# Altium schematic sheet 8586.SchDoc
size A1
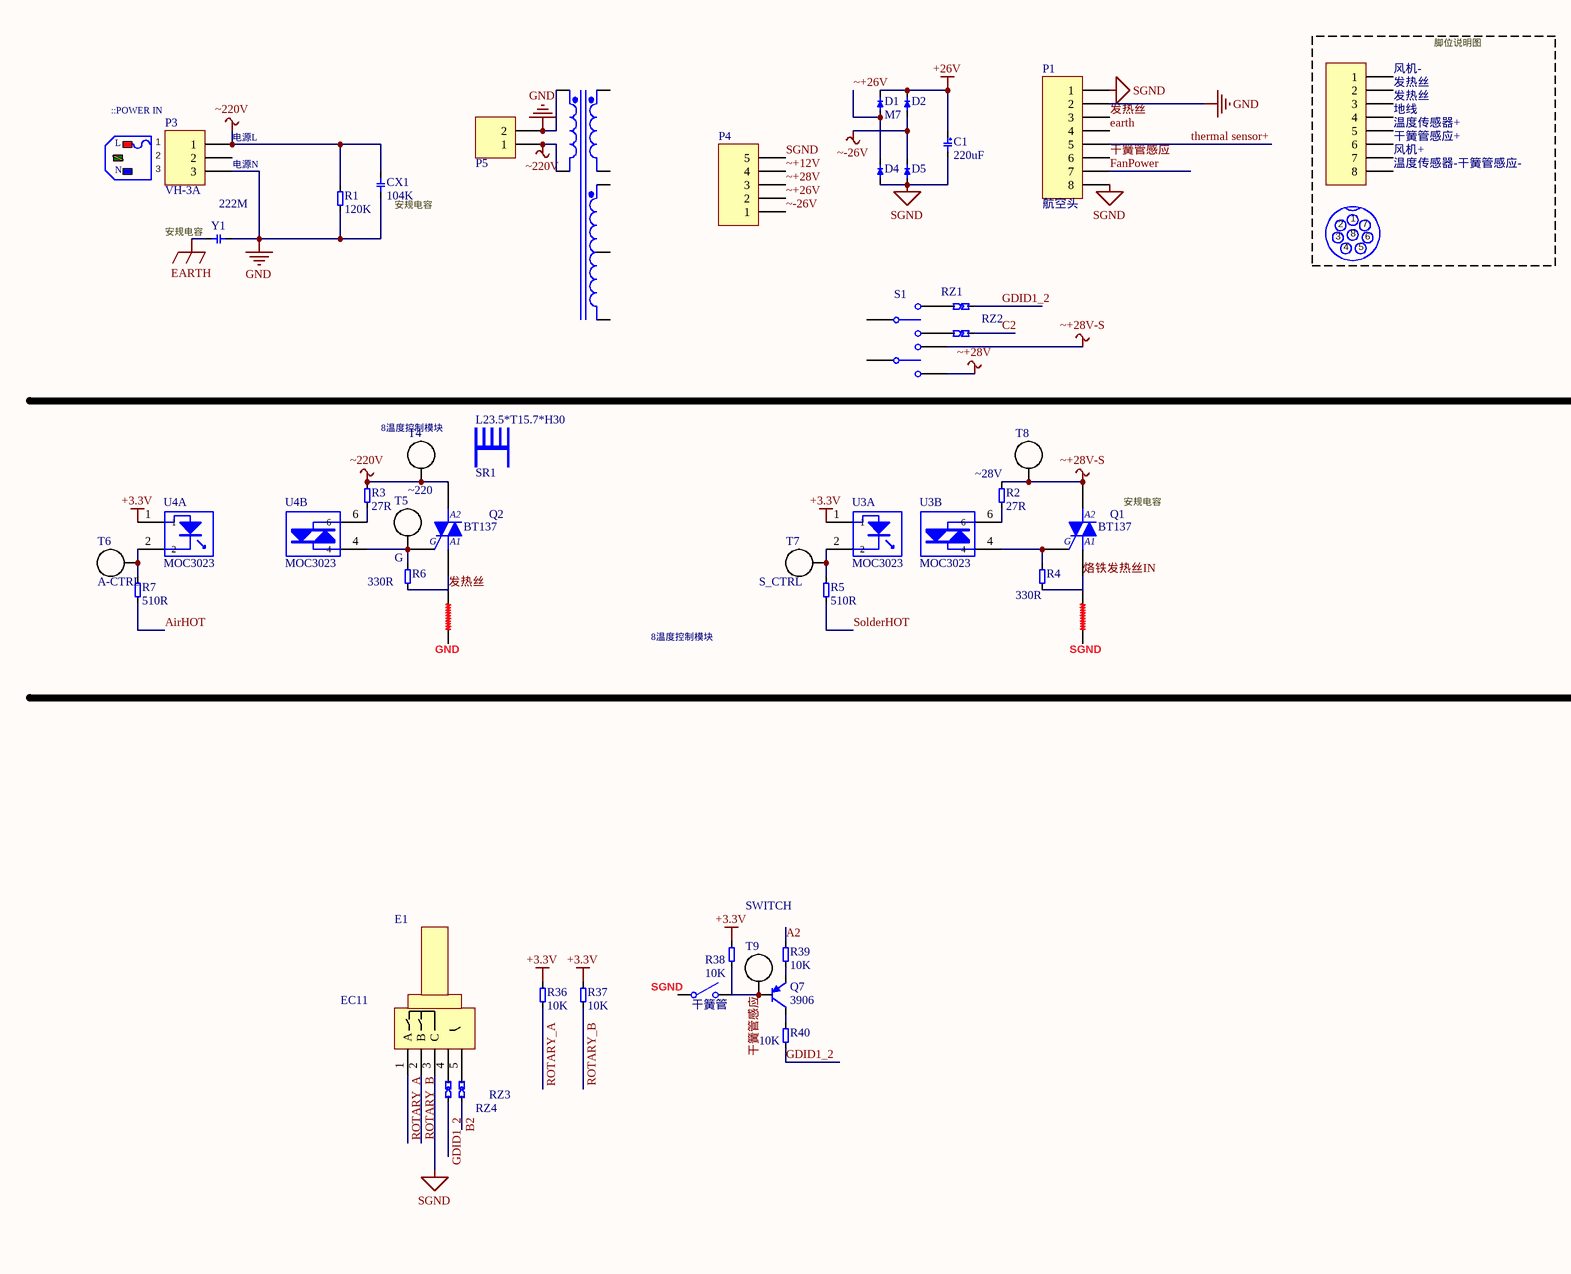
[diagram p0: 8586.SchDoc, top left]
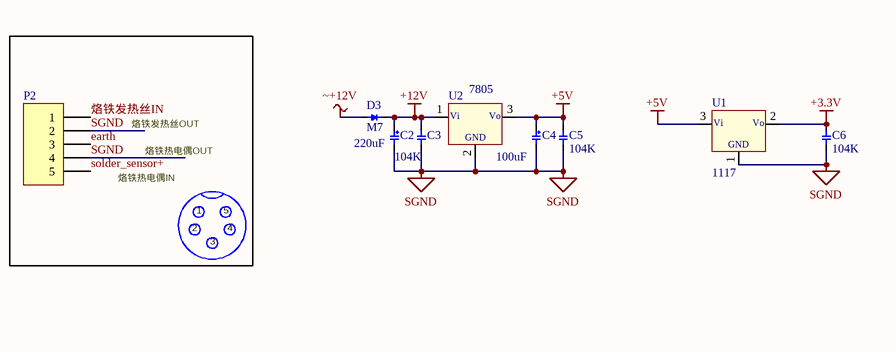
[diagram p1: 8586.SchDoc, top right]
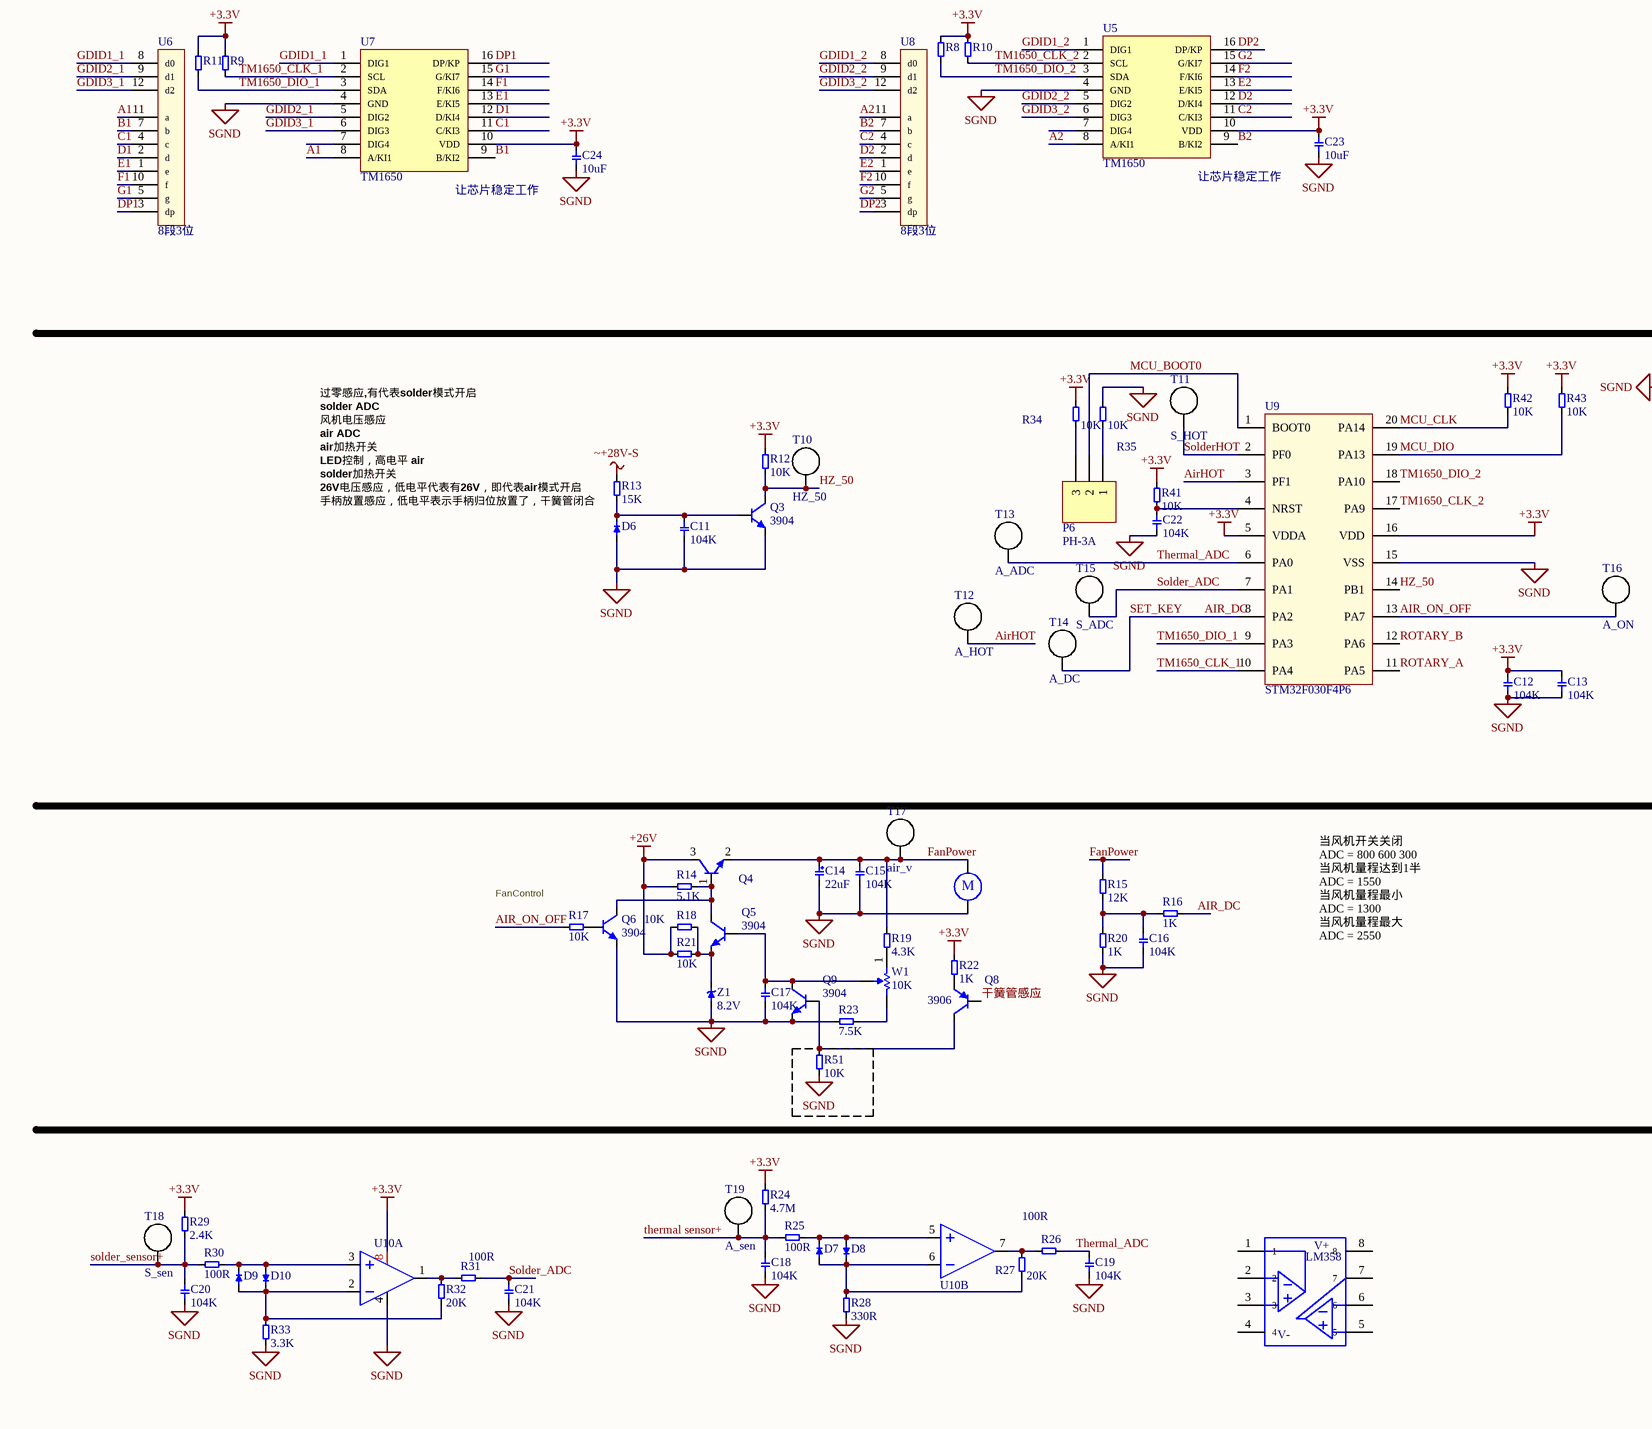
[diagram p2: 8586.SchDoc, bottom left]
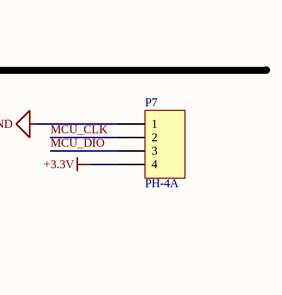
[diagram p3: 8586.SchDoc, bottom right]

## Parts
(Parts that share a designator on the sheet are numbered #1, #2 ... from top to bottom, then left to right.)
?#1  发热丝图  [CON2-3.96]  (value not drawn)  (graphical)
?#2  发热丝图  [CON2-3.96]  (value not drawn)  (graphical)
B?  Motor  [2PIN孔1.7]  (value not drawn)  (graphical)
C1  220uF  [P5D13H27]
C2  220uF  [P3.5D8H13]
C3  104K  [0805]
C4  100uF  [P2.54D5H11]
C5  104K  [0805]
C6  104K  [0805]
C11  104K  [0805]
C12  104K  [0805]
C13  104K  [0805]
C14  22uF  [P2.54D5H11]
C15  104K  [0805]
C16  104K  [0805]
C17  104K  [0805]
C18  104K  [0805]
C19  104K  [0805]
C20  104K  [0805]
C21  104K  [0805]
C22  104K  [0805]
C23  10uF  [0805]
C24  10uF  [0805]
CX1  104K  [方形P15T6L18H12]
D1  M7  [SMA]
D2  M7  [SMA]  (value not drawn)
D3  M7  [SMA]
D4  M7  [SMA]  (value not drawn)
D5  M7  [SMA]  (value not drawn)
D6  M7  [SMA]  (value not drawn)
D7  M7  [SOD123]  (value not drawn)
D8  M7  [SOD123]  (value not drawn)
D9  M7  [SOD123]  (value not drawn)
D10  M7  [SOD123]  (value not drawn)
E1  EC11  [EC11]
P1  航空头  [航空头8PIN]
P2  VH-5A  [航空头5PIN]  (value not drawn)
P3  VH-3A  [CON3-P3.96]
P4  VH-5A  [CON5-P3.96]  (value not drawn)
P5#1  航空头8PIN  [航空头8PIN]  (value not drawn)  (graphical)
P5#2  VH-2A  [CON2-P3.96]  (value not drawn)
P6  PH-3A  [CON3-P2.54]
P7  PH-4A  [CON4-P2.54]
P?#1  品字插座  [IEC9.14-2H3]  (value not drawn)  (graphical)
P?#2  航空头5PIN  (value not drawn)  (graphical)
P?#3  航空头8PIN  (value not drawn)  (graphical)
Q1  BT137  [TO-220-3L-P2.54]
Q2  BT137  [TO-220-3L-P2.54]
Q3  3904  [SOT-23-3L]
Q4  TIP122  [TO-220-3L-P2.54]  (value not drawn)
Q5  3904  [SOT-23-3L]
Q6  3904  [SOT-23-3L]
Q7  3906  [SOT-23-3L]
Q8  3906  [SOT-23-3L]
Q9  3904  [SOT-23-3L]
R1  120K  [1206]
R2  27R  [0805]
R3  27R  [0805]
R4  330R  [0805]
R5  510R  [0805]
R6  330R  [0805]
R7  510R  [0805]
R8  10K  [0805]  (value not drawn)
R9  10K  [0805]  (value not drawn)
R10  10K  [0805]  (value not drawn)
R11  10K  [0805]  (value not drawn)
R12  10K  [0805]
R13  15K  [0805]
R14  5.1K  [0805]
R15  12K  [0805]
R16  1K  [0805]
R17  10K  [0805]
R18  10K  [0805]
R19  4.3K  [0805]
R20  1K  [0805]
R21  10K  [0805]
R22  1K  [0805]
R23  7.5K  [0805]
R24  4.7M  [0805]
R25  100R  [0805]
R26  100R  [0805]
R27  20K  [0805]
R28  330R  [0805]
R29  2.4K  [0805]
R30  100R  [0805]
R31  100R  [0805]
R32  20K  [0805]
R33  3.3K  [0805]
R34  10K  [0805]
R35  10K  [0805]
R36  10K  [0805]
R37  10K  [0805]
R38  10K  [0805]
R39  10K  [0805]
R40  10K  [0805]
R41  10K  [0805]
R42  10K  [0805]
R43  10K  [0805]
R51  10K  [0805]
RZ1  (no value)  [跳线-小]  (no BOM)
RZ2  (no value)  [跳线-小]  (no BOM)
RZ3  (no value)  [跳线2012]  (no BOM)
RZ4  (no value)  [跳线2012]  (no BOM)
S1  KCD6  [开关-船式 - 双]  (value not drawn)
S?  干簧管  [SPST-2]  (graphical)
SR1  L23.5*T15.7*H30  [散热片L23.5*T15.7*H30]
T4  ~220  [test_dot_6]
T5  G  [test_dot_6]
T6  A-CTRL  [test_dot_6]
T7  S_CTRL  [test_dot_6]
T8  ~28V  [test_dot_6]
T9  SWITCH  [test_dot_6]
T10  HZ_50  [test_dot_6]
T11  S_HOT  [test_dot_6]
T12  A_HOT  [test_dot_6]
T13  A_ADC  [test_dot_6]
T14  A_DC  [test_dot_6]
T15  S_ADC  [test_dot_6]
T16  A_ON  [test_dot_6]
T17  air_v  [test_dot_6]
T18  S_sen  [test_dot_6]
T19  A_sen  [test_dot_6]
T?  Trans4_1  [TRF_8]  (value not drawn)  (graphical)
U1  1117  [SOT89L]
U2  7805  [TO-220-3L-P2.54]
U3  MOC3023  [SOP-6]  (parts A,B of 2)
U4  MOC3023  [SOP-6]  (parts A,B of 2)
U5  TM1650  [SOIC16_39MM]
U6  8段3位  [数码管]
U7  TM1650  [SOIC16_39MM]
U8  8段3位  [数码管]
U9  STM32F030F4P6  [TSSOP20引脚加长]
U10  LM358  [SOIC8_39MM]  (value not drawn)  (parts A,B of 2)
U?  LM358  [DIP-8]  (graphical)
W1  10K  [R16P5.083PIN]
Y1  222M  [椭圆T3.3P10]
Z1  8.2V  [SOD123]

## Nets
+3.3V: C6.2 C12.2 C13.2 C23.2 C24.2 P7.4 R8.2 R9.2 R10.2 R11.2 R12.2 R22.1 R24.1 R29.1 R34.2 R36.2 R37.2 R38.2 R41.1 R42.2 R43.2 U1.2(Vo) U3.1 U4.1 U5.10(VDD) U7.10(VDD) U9.5(VDDA) U9.16(VDD) U10.8(V+)
+5V: C4.1 C5.2 U1.3(Vi) U2.3(GND)
+12V: C2.1 C3.2 D3.1 U2.1(INPUT)
+26V: C1.1 D1.1 D2.1 Q4.3(C) R14.2 R18.2 R21.2
earth: P1.4 P2.3 Y1.1
GND: CX1.1 P1.2 P3.3 P5#2.2 R1.1 T?.1(Pri+) Y1.2
SGND: B?.2 C1.2 C2.2 C3.1 C4.2 C5.1 C6.1 C11.1 C12.1 C13.1 C14.2 C15.1 C16.1 C17.1 C18.1 C19.1 C20.1 C21.1 C22.1 C23.1 C24.1 D4.2 D5.2 D6.2 E1.3(C) P1.1 P1.8 P2.2 P2.4 P4.5 P7.1 Q3.2(E) Q6.2(E) Q9.2(E) R20.2 R23.2 R28.2 R33.2 R35.2 R51.2 U1.1(GND) U2.2(OUTPUT) U5.4(GND) U7.4(GND) U9.15(VSS) U10.4(V-) Z1.2
~220V: CX1.2 P3.1 P5#2.1 Q2.2(A2) R1.2 R3.2 T4.1 T?.2(Pri-)
~+12V: D3.2 P4.4
~+28V: P4.3 S1.6
~+28V-S: Q1.2(A2) R2.2 R13.2 S1.5 T8.1
~-26V: D2.2 D5.1 P4.1
A1: U6.11(a) U7.8(A/KI1)
A2: R39.2 U5.8(A/KI1) U8.11(a)
AIR_DC: R16.2 T14.1 U9.8(PA2)  [also labelled SET_KEY]
AIR_ON_OFF: R17.2 T16.1 U9.13(PA7)
AirHOT: R7.2 T12.1 U9.3(PF1)
B1: U6.7(b) U7.9(B/KI2)
B2: RZ3.1 U5.9(B/KI2) U8.7(b)
C1: U6.4(c) U7.11(C/KI3)
C2: RZ2.2 U5.11(C/KI3) U8.4(c)
D1: U6.2(d) U7.12(D/KI4)
D2: U5.12(D/KI4) U8.2(d)
DP1: U6.3(dp) U7.16(DP/KP)
DP2: U5.16(DP/KP) U8.3(dp)
E1: U6.1(e) U7.13(E/KI5)
E2: U5.13(E/KI5) U8.1(e)
F1: U6.10(f) U7.14(F/KI6)
F2: U5.14(F/KI6) U8.10(f)
FanPower: B?.1 C14.1 C15.2 P1.7 Q4.2(E) R15.1 R19.1 T17.1
G1: U6.5(g) U7.15(G/KI7)
G2: U5.15(G/KI7) U8.5(g)
GDID1_1: U6.8(d0) U7.1(DIG1)
GDID1_2: R40.1 RZ1.2 RZ4.1 U5.1(DIG1) U8.8(d0)
GDID2_1: U6.9(d1) U7.5(DIG2)
GDID2_2: U5.5(DIG2) U8.9(d1)
GDID3_1: U6.12(d2) U7.6(DIG3)
GDID3_2: U5.6(DIG3) U8.12(d2)
HZ_50: Q3.3(C) R12.1 T10.1 U9.14(PB1)
MCU_BOOT0: P6.2 U9.1(BOOT0)
MCU_CLK: P7.2 R42.1 U9.20(PA14)
MCU_DIO: P7.3 R43.1 U9.19(PA13)
ROTARY_A: E1.1(A) R36.1 U9.11(PA5)
ROTARY_B: E1.2(B) R37.1 U9.12(PA6)
Solder_ADC: C21.2 R31.1 T15.1 U9.7(PA1)
solder_sensor+: C20.2 P2.5 R29.2 R30.1 T18.1
SolderHOT: R5.2 T11.1 U9.2(PF0)
thermal sensor+: C18.2 P1.5 R24.2 R25.1 T19.1
Thermal_ADC: C19.2 R26.1 T13.1 U9.6(PA0)
TM1650_CLK_1: R9.1 U7.2(SCL) U9.10(PA4)
TM1650_CLK_2: R10.1 U5.2(SCL) U9.17(PA9)
TM1650_DIO_1: R11.1 U7.3(SDA) U9.9(PA3)
TM1650_DIO_2: R8.1 U5.3(SDA) U9.18(PA10)
~+26V: D1.2 D4.1 P4.2
发热丝: ?#1.1 P1.3 Q2.1(A1) R6.2
干簧管感应: P1.6 Q7.1(B) Q8.1(B) R38.1 S?.2(NO) T9.1
烙铁发热丝IN: ?#2.1 P2.1 Q1.1(A1) R4.2
NetC11_2: C11.2 D6.1 Q3.1(B) R13.1
NetC16_2: C16.2 R15.2 R16.1 R20.1
NetC17_2: C17.2 Q5.1(B) Q9.3(C) W1.2
NetC22_2: C22.2 R41.2 U9.4(NRST)
NetD7_1: D7.1 D8.2 R25.2 U10.5(IN2+)
NetD7_2: D7.2 D8.1 R27.2 R28.1 U10.6(IN2-)
NetD9_1: D9.1 D10.2 R30.2 U10.3(IN1+)
NetD9_2: D9.2 D10.1 R32.2 R33.1 U10.2(IN1-)
NetE1_4: E1.4 RZ4.2
NetE1_5: E1.5 RZ3.2
NetP6_1: P6.1 R35.1
NetP6_3: P6.3 R34.1
NetQ1_3: Q1.3(G) R4.1 U3.4
NetQ2_3: Q2.3(G) R6.1 T5.1 U4.4
NetQ4_1: Q4.1(B) Q5.3(C) Q6.3(C) R14.1
NetQ5_2: Q5.2(E) R18.1 R21.1 Z1.1
NetQ6_1: Q6.1(B) R17.1
NetQ7_2: Q7.2(E) R39.1
NetQ7_3: Q7.3(C) R40.2
NetQ8_2: Q8.2(E) R22.2
NetQ8_3: Q8.3(C) Q9.1(B) R51.1
NetR2_1: R2.1 U3.6
NetR3_1: R3.1 U4.6
NetR5_1: R5.1 T7.1 U3.2
NetR7_1: R7.1 T6.1 U4.2
NetR19_2: R19.2 W1.1
NetR23_1: R23.1 W1.3
NetR26_2: R26.2 R27.1 U10.7(OUT2)
NetR31_2: R31.2 R32.1 U10.1(OUT1)
NetRZ1_1: RZ1.1 S1.2
NetRZ2_1: RZ2.1 S1.3

Not connected (* = marked no-connect by the designer): ?#1 2; ?#2 2; P3 2; P5#1 1 2 3 4 5 6 7 8; S1 1 4; S? 1(COMMON); T? 3(Sec1+) 4(Sec1-) 5(Sec2+) 6(Sec2-) 8(Sec3-); U5 7(DIG4); U7 7(DIG4); U? 1 2 3 4 5 6 7 8

## Notes on the sheet
- 脚位说明图
- (near P?#1) ::POWER IN
- (near P5#1) 风机-
- (near P5#1) 发热丝
- (near P5#1) 地线
- (near P3) 电源N
- (near P3) 电源L
- (near P5#1) 温度传感器+
- (near P5#1) 干簧管感应+
- (near P5#1) 风机+
- (near P5#1) 温度传感器-干簧管感应-
- 烙铁热电偶IN
- 烙铁发热丝OUT
- 烙铁热电偶OUT
- (near Y1) 安规电容
- (near CX1) 安规电容
- (near T4) 8温度控制模块
- (near Q1) 安规电容
- GND
- 8温度控制模块
- SGND
- (near S?) SGND
- (near U7) 让芯片稳定工作
- (near U5) 让芯片稳定工作
- 过零感应,有代表solder模式开启
- 风机电压感应
- solder ADC
- air ADC
- 26V电压感应，低电平代表有26V，即代表air模式开启
- 手柄放置感应，低电平表示手柄归位放置了，干簧管闭合
- LED控制，高电平 air
- air加热开关
- solder加热开关
- (near R17) FanControl
- 当风机开关关闭
  ADC = 800 600 300
  当风机量程达到1半
  ADC = 1550
  当风机量程最小
  ADC = 1300
  当风机量程最大
  ADC = 2550
- Title
- Size:
- Date:
- File:
- A1
- Number:
- Time:
- Revision:
- Sheet
- of
- (in symbol 7805) Vi; Vo
- (in symbol Motor) M
- (in symbol Plug AC Male_fuse) L; 1; 2; N; 3
- (in symbol 航空头5PIN) 1; 5; 2; 4; 3
- (in symbol 航空头8PIN) 1; 2; 7; 8; 3; 6; 4; 5
- (in symbol 运放LM358) V+; V-

## Library data of the parts
B? = Motor: Motor, General Kind; Published: 24-Mar-1999; LatestRevisionDate: 17-Jul-2002; LatestRevisionNote: Re-released for DXP Platform.; PackageReference: RB5-10.5; Publisher: Altium Limited
C1 = Cap Pol: 极性电容; specifications: 220uF,50V,±20%; Published: 8-Jun-2000; LatestRevisionDate: 17-Jul-2002; LatestRevisionNote: Re-released for DXP Platform.; PackageReference: RB7.6-15; Publisher: Altium Limited; Value: 220uF
C2 = Cap Pol: 极性电容; specifications: 220uF,25V,±20%; Published: 8-Jun-2000; LatestRevisionDate: 17-Jul-2002; LatestRevisionNote: Re-released for DXP Platform.; PackageReference: RB7.6-15; Publisher: Altium Limited; Value: 220uF
C3 C5 C6 C11-C13 C15-C24 = Cap: 电容; Specifications: 104K,16V,±10%; Published: 8-Jun-2000; LatestRevisionDate: 17-Jul-2002; LatestRevisionNote: Re-released for DXP Platform.; PackageReference: RAD-0.3; Publisher: Altium Limited
  C3 C5 C6 C11-C13 C15-C22: Value: 104K
  C23 C24: Value: 10uF
C4 = Cap Pol: 极性电容; specifications: 100uF,25V,±20%; Published: 8-Jun-2000; LatestRevisionDate: 17-Jul-2002; LatestRevisionNote: Re-released for DXP Platform.; PackageReference: RB7.6-15; Publisher: Altium Limited; Value: 100uF
C14 = Cap Pol: 极性电容; specifications: 22uF,50V,±20%; Published: 8-Jun-2000; LatestRevisionDate: 17-Jul-2002; LatestRevisionNote: Re-released for DXP Platform.; PackageReference: RB7.6-15; Publisher: Altium Limited; Value: 22uF
CX1 = Cap: 安规电容; Specifications: 104K,275V; Published: 8-Jun-2000; LatestRevisionDate: 17-Jul-2002; LatestRevisionNote: Re-released for DXP Platform.; PackageReference: RAD-0.3; Publisher: Altium Limited; Value: 104K
D1-D10 = Diode: 二极管; Published: 8-Jun-2000; LatestRevisionDate: 17-Jul-2002; LatestRevisionNote: Re-released for DXP Platform.; PackageVersion: Sep-1996; PackageReference: SMC; Publisher: Altium Limited; Code_JEDEC: DO-214-AB; value: M7; Specifications: M7
E1 = EC11_S: 旋转编码器; value: EC11; specifications: *
P1 = Header 8: 连接器; LatestRevisionDate: 17-Jul-2002; LatestRevisionNote: Re-released for DXP Platform.; Publisher: Altium Limited; Value: 航空头; specifications: 航空头
P2 P4 = Header 5: 连接器; Specifications: VH-5A直脚; LatestRevisionDate: 17-Jul-2002; LatestRevisionNote: Re-released for DXP Platform.; Publisher: Altium Limited; Value: VH-5A
P3 = Header 3: 连接器; Specifications: VH-3A直脚; LatestRevisionDate: 17-Jul-2002; LatestRevisionNote: Re-released for DXP Platform.; Publisher: Altium Limited; Value: VH-3A
P5#1 = Header 8: Header, 8-Pin; LatestRevisionDate: 17-Jul-2002; LatestRevisionNote: Re-released for DXP Platform.; Publisher: Altium Limited
P5#2 = Header 2: 连接器; Specifications: VH-2A直脚; LatestRevisionDate: 17-Jul-2002; LatestRevisionNote: Re-released for DXP Platform.; Publisher: Altium Limited; Value: VH-2A
P6 = Header 3: 连接器; Specifications: PH-3A直脚; LatestRevisionDate: 17-Jul-2002; LatestRevisionNote: Re-released for DXP Platform.; Publisher: Altium Limited; Value: PH-3A
P7 = Header 4: 连接器; LatestRevisionDate: 17-Jul-2002; LatestRevisionNote: Re-released for DXP Platform.; Publisher: Altium Limited; Value: PH-4A; specifications: PH-4A
P?#1 = Plug AC Male_fuse: 220V
Q1 Q2 = Triac: 可控硅; Note: Pin 2 is electrically connected to Pin 4 (TAB); Published: 29-Sep-2000; LatestRevisionDate: 17-Jul-2002; LatestRevisionNote: Re-released for DXP Platform.; DatasheetVersion: 1999; PackageReference: 369-03; Publisher: Altium Limited; Code_JEDEC: TO-251-AA; ComponentLink1Description: Manufacturer Link; ComponentLink1URL: http://www.motorola.com/; value: BT137; specifications: BT137
Q3 Q5 Q6 Q9 = transistor NPN: 三极管; Published: 8-Jun-2000; LatestRevisionDate: 17-Jul-2002; LatestRevisionNote: Re-released for DXP Platform.; PackageReference: TO-226; Publisher: Altium Limited; Code_JEDEC: TO-226-AA; Value: 3904; specifications: *
Q4 = TIP122: NPN; pin to pad: 2>3 3>2; Published: 8-Jun-2000; LatestRevisionDate: 17-Jul-2002; LatestRevisionNote: Re-released for DXP Platform.; PackageReference: TO-226; Publisher: Altium Limited; Code_JEDEC: TO-226-AA; value: TIP122; specifications: TIP122
Q7 Q8 = transistor PNP: 三极管; Published: 8-Jun-2000; LatestRevisionDate: 29-May-2009; LatestRevisionNote: IPC-7351 Footprint Added.; PackageVersion: Aug-1999; PackageReference: SOT-23B; Publisher: Altium Limited; PackageDescription: 3-Pin SOT-23 Package 0.95 mm Pitch, 2.4 mm Lead Span; Value: 3906; specifications: 3906
R1 = Res1: 电阻; Specifications: 120K,±1%; Published: 8-Jun-2000; LatestRevisionDate: 17-Jul-2002; LatestRevisionNote: Re-released for DXP Platform.; PackageReference: AXIAL-0.3; Publisher: Altium Limited; Value: 120K
R2 R3 = Res1: 电阻; Specifications: 27R,±1%; Published: 8-Jun-2000; LatestRevisionDate: 17-Jul-2002; LatestRevisionNote: Re-released for DXP Platform.; PackageReference: AXIAL-0.3; Publisher: Altium Limited; Value: 27R
R4 R6 R28 = Res1: 电阻; Specifications: 330R,±1%; Published: 8-Jun-2000; LatestRevisionDate: 17-Jul-2002; LatestRevisionNote: Re-released for DXP Platform.; PackageReference: AXIAL-0.3; Publisher: Altium Limited; Value: 330R
R5 R7 = Res1: 电阻; Specifications: 510R,±1%; Published: 8-Jun-2000; LatestRevisionDate: 17-Jul-2002; LatestRevisionNote: Re-released for DXP Platform.; PackageReference: AXIAL-0.3; Publisher: Altium Limited; Value: 510R
R8-R12 R17 R18 R21 R34-R40 R42 R43 R51 = Res1: 电阻; Specifications: 10K,±1%; Published: 8-Jun-2000; LatestRevisionDate: 17-Jul-2002; LatestRevisionNote: Re-released for DXP Platform.; PackageReference: AXIAL-0.3; Publisher: Altium Limited; Value: 10K
R13 = Res1: 电阻; Specifications: 15K,±1%; Published: 8-Jun-2000; LatestRevisionDate: 17-Jul-2002; LatestRevisionNote: Re-released for DXP Platform.; PackageReference: AXIAL-0.3; Publisher: Altium Limited; Value: 15K
R14 = Res1: 电阻; Specifications: 5.1K,±1%; Published: 8-Jun-2000; LatestRevisionDate: 17-Jul-2002; LatestRevisionNote: Re-released for DXP Platform.; PackageReference: AXIAL-0.3; Publisher: Altium Limited; Value: 5.1K
R15 = Res1: 电阻; Specifications: 12K,±1%; Published: 8-Jun-2000; LatestRevisionDate: 17-Jul-2002; LatestRevisionNote: Re-released for DXP Platform.; PackageReference: AXIAL-0.3; Publisher: Altium Limited; Value: 12K
R16 R20 R22 R41 = Res1: 电阻; Specifications: 1K,±1%; Published: 8-Jun-2000; LatestRevisionDate: 17-Jul-2002; LatestRevisionNote: Re-released for DXP Platform.; PackageReference: AXIAL-0.3; Publisher: Altium Limited
  R16 R20 R22: Value: 1K
  R41: Value: 10K
R19 = Res1: 电阻; Specifications: 4.3K,±1%; Published: 8-Jun-2000; LatestRevisionDate: 17-Jul-2002; LatestRevisionNote: Re-released for DXP Platform.; PackageReference: AXIAL-0.3; Publisher: Altium Limited; Value: 4.3K
R23 = Res1: 电阻; Specifications: 7.5K,±1%; Published: 8-Jun-2000; LatestRevisionDate: 17-Jul-2002; LatestRevisionNote: Re-released for DXP Platform.; PackageReference: AXIAL-0.3; Publisher: Altium Limited; Value: 7.5K
R24 = Res1: 电阻; Specifications: 4.7M,±1%; Published: 8-Jun-2000; LatestRevisionDate: 17-Jul-2002; LatestRevisionNote: Re-released for DXP Platform.; PackageReference: AXIAL-0.3; Publisher: Altium Limited; Value: 4.7M
R25 R26 R30 R31 = Res1: 电阻; Specifications: 100R,±1%; Published: 8-Jun-2000; LatestRevisionDate: 17-Jul-2002; LatestRevisionNote: Re-released for DXP Platform.; PackageReference: AXIAL-0.3; Publisher: Altium Limited; Value: 100R
R27 R32 = Res1: 电阻; Specifications: 20K,±1%; Published: 8-Jun-2000; LatestRevisionDate: 17-Jul-2002; LatestRevisionNote: Re-released for DXP Platform.; PackageReference: AXIAL-0.3; Publisher: Altium Limited; Value: 20K
R29 = Res1: 电阻; Specifications: 2.4K,±1%; Published: 8-Jun-2000; LatestRevisionDate: 17-Jul-2002; LatestRevisionNote: Re-released for DXP Platform.; PackageReference: AXIAL-0.3; Publisher: Altium Limited; Value: 2.4K
R33 = Res1: 电阻; Specifications: 3.3K,±1%; Published: 8-Jun-2000; LatestRevisionDate: 17-Jul-2002; LatestRevisionNote: Re-released for DXP Platform.; PackageReference: AXIAL-0.3; Publisher: Altium Limited; Value: 3.3K
RZ1-RZ4 = Res0: 电阻; Value: 1K; Published: 8-Jun-2000; LatestRevisionDate: 17-Jul-2002; LatestRevisionNote: Re-released for DXP Platform.; PackageReference: AXIAL-0.3; Publisher: Altium Limited
S1 = 开关2-3: Double-Pole, Double-Throw Switch; Published: 24-Mar-1999; LatestRevisionDate: 17-Jul-2002; LatestRevisionNote: Re-released for DXP Platform.; PackageReference: DPDT-6; Publisher: Altium Limited; value: KCD6; Specifications: KCD6
S? = SW-SPST: Published: 24-Mar-1999; LatestRevisionDate: 17-Jul-2002; LatestRevisionNote: Re-released for DXP Platform.; PackageReference: SPST-2; Publisher: Altium Limited
SR1 = 散热片: value: L23.5*T15.7*H30; specifications: *
T4-T19 = Test_dot: 测试点
T? = Trans4_1: Four-winding Transformer (Non-Ideal); Sim Note: Enter the turns ratios, Core loss resistance, Magnetising Reactance, Leakage Reactances and Resistances referred to the primary side into the parameter fields.; Published: 25-Jan-2001; LatestRevisionDate: 17-Jul-2002; LatestRevisionNote: Re-released for DXP Platform.; PackageReference: TRF_8; Publisher: Altium Limited
U1 = 1117: 三端稳压器; Value: 1117
U2 = 7805: 三端稳压器; Value: 7805
U5 U7 = TM1650: 数码管驱动IC; value: TM1650; specifications: TM1650
U6 U8 = 数码管
U9 = STM32F030F4
U10 = LM358: 运放; Value: LM358; specifications: LM358
U? = 运放LM358: 运放
W1 = Res Adj: 可调电阻; Set Position: 0.5; Specifications: ±20%; Published: 8-Jun-2000; LatestRevisionDate: 17-Jul-2002; PackageReference: AXIAL-0.7; Publisher: Altium Limited; Value: 10K; LatestRevisionNote: 电位器正对你方正，顺时针旋转，12脚之间电阻增加
Y1 = Cap: 安规电容; Specifications: 222M/400V; Published: 8-Jun-2000; LatestRevisionDate: 17-Jul-2002; LatestRevisionNote: Re-released for DXP Platform.; PackageReference: RAD-0.3; Publisher: Altium Limited; Value: 222M
Z1 = diode Zener: 稳压管; Published: 8-Jun-2000; LatestRevisionDate: 17-Jul-2002; LatestRevisionNote: Re-released for DXP Platform.; PackageReference: DIODE-0.7; Publisher: Altium Limited; Value: 8.2V; Specifications: 8.2v
U3 U4 = MOC3023: Published: 24-Mar-1999; LatestRevisionDate: 17-Jul-2002; LatestRevisionNote: Re-released for DXP Platform.; PackageReference: NPSIP4A; Publisher: Altium Limited; Value: MOC3023; specifications: MOC3023